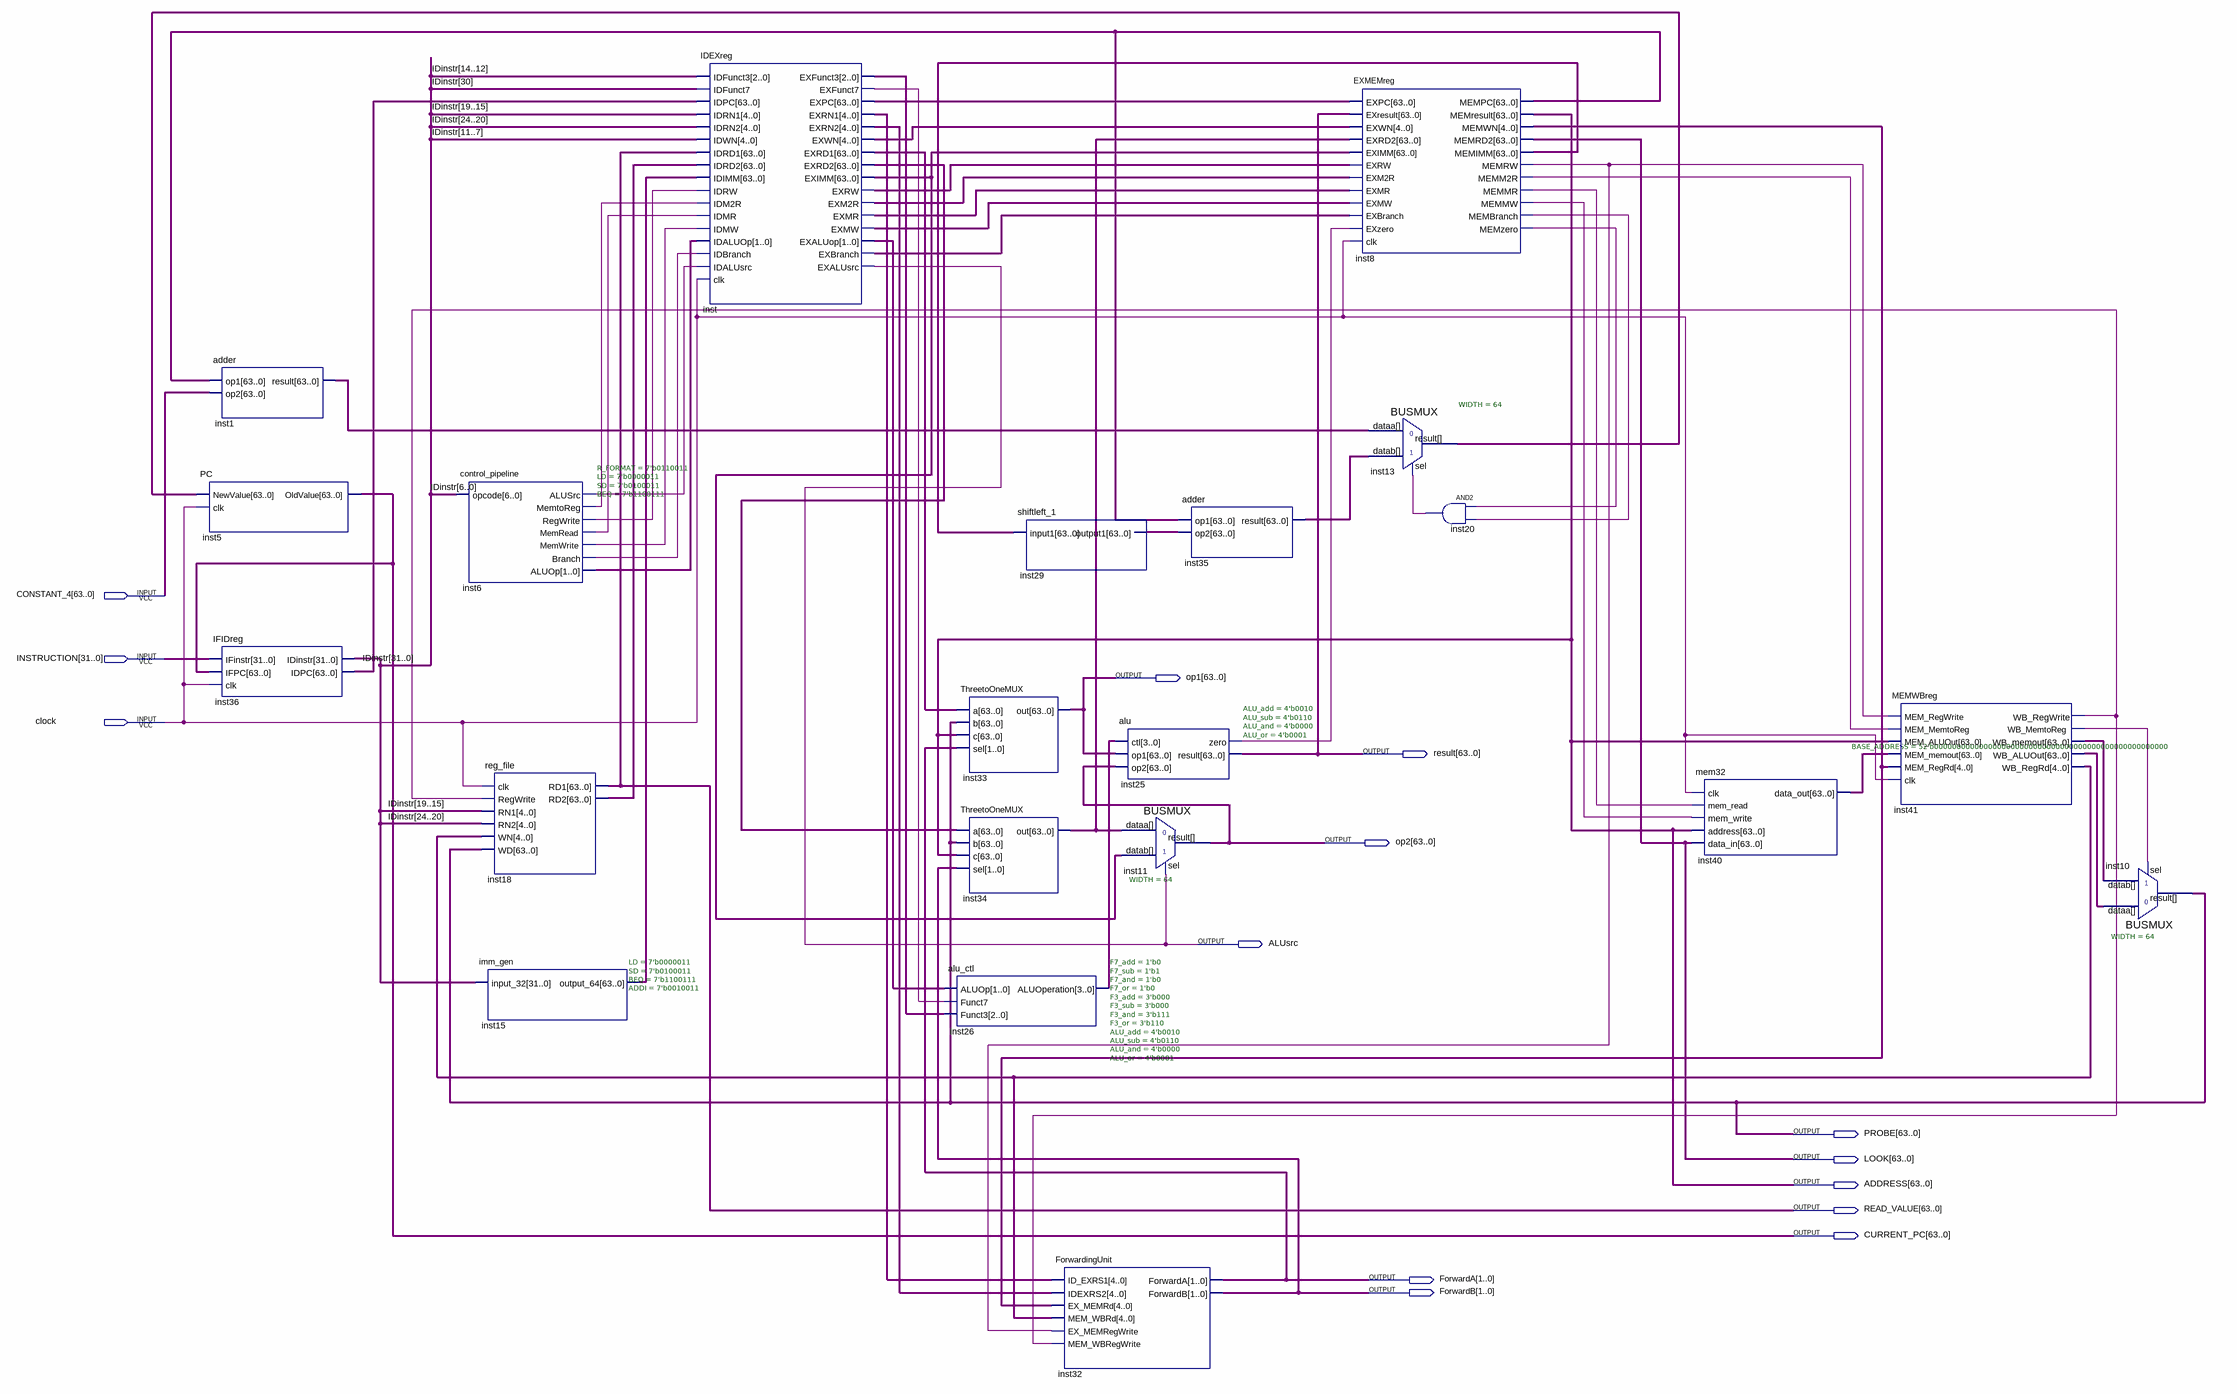
[diagram p0: schematic sheet]
// Quartus schematic top_level_KMC.bdf as structural Verilog: 21 symbols, 14 pins
module top_level_KMC (
  input  [63:0] CONSTANT_4,
  input  [31:0] INSTRUCTION,
  input  clock,
  output [63:0] op1,
  output [63:0] result,
  output [63:0] op2,
  output ALUsrc,
  output [63:0] PROBE,
  output [63:0] LOOK,
  output [63:0] ADDRESS,
  output [63:0] READ_VALUE,
  output [63:0] CURRENT_PC,
  output [1:0] ForwardA,
  output [1:0] ForwardB
);

  wire inst6_alusrc, inst6_branch, inst6_memread, inst6_memtoreg, inst6_memwrite, inst6_regwrite,
       inst8_membranch, inst8_memm2r, inst8_memmr, inst8_memmw, inst8_memrw, inst8_memzero, inst20_out,
       inst25_zero, inst41_wb_memtoreg, inst41_wb_regwrite, inst_exbranch, inst_exfunct7, inst_exm2r,
       inst_exmr, inst_exmw, inst_exrw;
  wire [1:0] inst6_aluop, inst_exaluop;
  wire [2:0] inst_exfunct3;
  wire [3:0] inst26_aluoperation;
  wire [4:0] inst8_memwn, inst41_wb_regrd, inst_exrn1, inst_exrn2, inst_exwn;
  wire [31:0] IDinstr;
  wire [63:0] inst1_result, inst8_memimm, inst8_mempc, inst13_result, inst15_output_64, inst18_rd2,
       inst29_output1, inst34_out, inst35_result, inst36_idpc, inst40_data_out, inst41_wb_aluout,
       inst41_wb_memout, inst_eximm, inst_expc, inst_exrd1, inst_exrd2;

  PC inst5 (.NewValue(inst13_result), .clk(clock), .OldValue(CURRENT_PC));
  adder inst1 (.op1(inst8_mempc), .op2(CONSTANT_4), .result(inst1_result));
  IFIDreg inst36 (.IFinstr(INSTRUCTION), .IFPC(CURRENT_PC), .clk(clock), .IDinstr(IDinstr), .IDPC(inst36_idpc));
  control_pipeline #(.R_FORMAT(7'b0110011), .LD(7'b0000011), .SD(7'b0100011), .BEQ(7'b1100111)) inst6 (
    .opcode(IDinstr[6:0]), .ALUSrc(inst6_alusrc), .MemtoReg(inst6_memtoreg), .RegWrite(inst6_regwrite),
    .MemRead(inst6_memread), .MemWrite(inst6_memwrite), .Branch(inst6_branch), .ALUOp(inst6_aluop));
  reg_file inst18 (
    .clk(clock), .RegWrite(inst41_wb_regwrite), .RN1(IDinstr[19:15]), .RN2(IDinstr[24:20]),
    .WN(inst41_wb_regrd), .WD(PROBE), .RD1(READ_VALUE), .RD2(inst18_rd2));
  imm_gen #(.LD(7'b0000011), .SD(7'b0100011), .BEQ(7'b1100111), .ADDI(7'b0010011)) inst15 (
    .input_32(IDinstr), .output_64(inst15_output_64));
  IDEXreg inst (
    .IDFunct3(IDinstr[14:12]), .IDFunct7(IDinstr[30]), .IDPC(inst36_idpc), .IDRN1(IDinstr[19:15]),
    .IDRN2(IDinstr[24:20]), .IDWN(IDinstr[11:7]), .IDRD1(READ_VALUE), .IDRD2(inst18_rd2),
    .IDIMM(inst15_output_64), .IDRW(inst6_regwrite), .IDM2R(inst6_memtoreg), .IDMR(inst6_memread),
    .IDMW(inst6_memwrite), .IDALUOp(inst6_aluop), .IDBranch(inst6_branch), .IDALUsrc(inst6_alusrc),
    .clk(clock), .EXFunct3(inst_exfunct3), .EXFunct7(inst_exfunct7), .EXPC(inst_expc), .EXRN1(inst_exrn1),
    .EXRN2(inst_exrn2), .EXWN(inst_exwn), .EXRD1(inst_exrd1), .EXRD2(inst_exrd2), .EXIMM(inst_eximm),
    .EXRW(inst_exrw), .EXM2R(inst_exm2r), .EXMR(inst_exmr), .EXMW(inst_exmw), .EXALUop(inst_exaluop),
    .EXBranch(inst_exbranch), .EXALUsrc(ALUsrc));
  ThreetoOneMUX inst33 (.a(inst_exrd1), .b(PROBE), .c(ADDRESS), .sel(ForwardA), .out(op1));
  ThreetoOneMUX inst34 (.a(inst_exrd2), .b(PROBE), .c(ADDRESS), .sel(ForwardB), .out(inst34_out));
  alu_ctl #(.F7_add(1'b0), .F7_sub(1'b1), .F7_and(1'b0), .F7_or(1'b0), .F3_add(3'b000), .F3_sub(3'b000), .F3_and(3'b111), .F3_or(3'b110), .ALU_add(4'b0010), .ALU_sub(4'b0110), .ALU_and(4'b0000), .ALU_or(4'b0001)) inst26 (
    .ALUOp(inst_exaluop), .Funct7(inst_exfunct7), .Funct3(inst_exfunct3), .ALUOperation(inst26_aluoperation));
  shiftleft_1 inst29 (.input1(inst8_memimm), .output1(inst29_output1));
  ForwardingUnit inst32 (
    .ID_EXRS1(inst_exrn1), .IDEXRS2(inst_exrn2), .EX_MEMRd(inst8_memwn), .MEM_WBRd(inst41_wb_regrd),
    .EX_MEMRegWrite(inst8_memrw), .MEM_WBRegWrite(inst41_wb_regwrite), .ForwardA(ForwardA),
    .ForwardB(ForwardB));
  alu #(.ALU_add(4'b0010), .ALU_sub(4'b0110), .ALU_and(4'b0000), .ALU_or(4'b0001)) inst25 (
    .ctl(inst26_aluoperation), .op1(op1), .op2(op2), .zero(inst25_zero), .result(result));
  BUSMUX #(.WIDTH(64)) inst11 (.datab(inst_eximm), .sel(ALUsrc), .dataa(inst34_out), .result(op2));
  adder inst35 (.op1(inst8_mempc), .op2(inst29_output1), .result(inst35_result));
  EXMEMreg inst8 (
    .EXPC(inst_expc), .EXresult(result), .EXWN(inst_exwn), .EXRD2(inst34_out), .EXIMM(inst_eximm),
    .EXRW(inst_exrw), .EXM2R(inst_exm2r), .EXMR(inst_exmr), .EXMW(inst_exmw), .EXBranch(inst_exbranch),
    .EXzero(inst25_zero), .clk(clock), .MEMPC(inst8_mempc), .MEMresult(ADDRESS), .MEMWN(inst8_memwn),
    .MEMRD2(LOOK), .MEMIMM(inst8_memimm), .MEMRW(inst8_memrw), .MEMM2R(inst8_memm2r), .MEMMR(inst8_memmr),
    .MEMMW(inst8_memmw), .MEMBranch(inst8_membranch), .MEMzero(inst8_memzero));
  BUSMUX #(.WIDTH(64)) inst13 (.datab(inst35_result), .sel(inst20_out), .dataa(inst1_result), .result(inst13_result));
  and inst20 (inst20_out, inst8_memzero, inst8_membranch);
  mem32 #(.BASE_ADDRESS(52'b0000000000000000000000000000000000000000000000000000)) inst40 (
    .clk(clock), .mem_read(inst8_memmr), .mem_write(inst8_memmw), .address(ADDRESS), .data_in(LOOK),
    .data_out(inst40_data_out));
  MEMWBreg inst41 (
    .MEM_RegWrite(inst8_memrw), .MEM_MemtoReg(inst8_memm2r), .MEM_ALUOut(ADDRESS),
    .MEM_memout(inst40_data_out), .MEM_RegRd(inst8_memwn), .clk(clock), .WB_RegWrite(inst41_wb_regwrite),
    .WB_MemtoReg(inst41_wb_memtoreg), .WB_memout(inst41_wb_memout), .WB_ALUOut(inst41_wb_aluout),
    .WB_RegRd(inst41_wb_regrd));
  BUSMUX #(.WIDTH(64)) inst10 (
    .datab(inst41_wb_memout), .sel(inst41_wb_memtoreg), .dataa(inst41_wb_aluout), .result(PROBE));
endmodule
